# EAGLE design Charge_Li_ION (EAGLE 7.6.0)
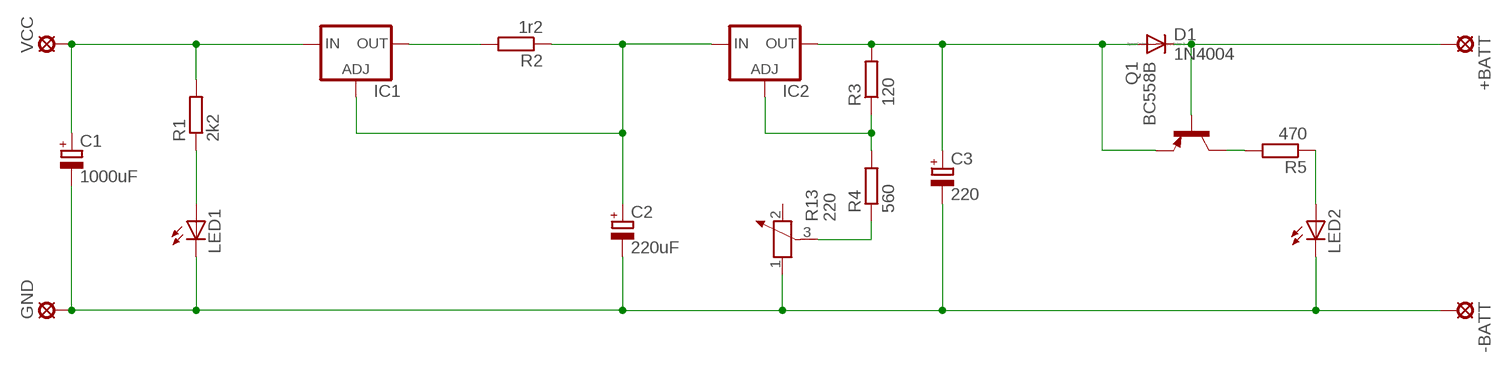
[diagram p0: schematic, sheet 1]

## Parts
+BATT  LSP13  [LSP13]
-BATT  LSP13  [LSP13]
C1  1000uF  CPOL-EUE3.5-8  [E3,5-8]
C2  220uF  CPOL-EUE3.5-8  [E3,5-8]
C3  220  CPOL-EUE3.5-8  [E3,5-8]
D1  1N4004  [DO41-10]
GND  LSP13  [LSP13]
IC1  LM317TS  [317TS]
IC2  LM317TS  [317TS]
LED1  LED5MM  [LED5MM]
LED2  LED5MM  [LED5MM]
Q1  BC558B  [TO92-EBC]
R1  2k2  R-EU_0207/7  [0207/7]
R2  1r2  R-EU_0207/7  [0207/7]
R3  120  R-EU_0207/7  [0207/7]
R4  560  R-EU_0207/7  [0207/7]
R5  470  R-EU_0207/7  [0207/7]
R13  220  POTENTIOMETER_PT-10  [PT-10]
VCC  LSP13  [LSP13]

## Nets
N$1: LED1.A R1.1
N$2: C1.+ IC1.3(IN) R1.2 VCC.MP
N$3: IC1.2(OUT) R2.2
N$5: -BATT.MP C1.- C2.- C3.- GND.MP LED1.K(C) LED2.K(C) R13.1
N$6: C2.+ IC1.1(ADJ) IC2.3(IN) R2.1
N$7: R4.1 R13.3
N$8: IC2.1(ADJ) R3.1 R4.2
N$9: C3.+ D1.A IC2.2(OUT) Q1.E R3.2
N$11: +BATT.MP D1.C Q1.B
N$13: Q1.C R5.2
N$14: LED2.A R5.1
Unconnected: R13.2

## Library data of the parts
+BATT -BATT GND VCC = solpad:LSP13: SOLDER PAD drill 1.3 mm, distributor Buerklin, 12H562
C1-C3 = rcl:CPOL-EU: POLARIZED CAPACITOR, European symbol
D1 = diode:1N4004: DIODE general purpose rectifier, 1 A
IC1 IC2 = v-reg:LM317TS: VOLTAGE REGULATOR
LED1 LED2 = led:LED: LED OSRAM: - CHIPLED LG R971, LG N971, LY N971, LG Q971, LY Q971, LO R971, LY R971 LH N974, LH R974 LS Q976, LO Q976, LY Q976 LO Q996 - Hyper CHIPLED LW Q18S LB Q993, LB Q99A, LB R99A - SideLED LS A670, LO A670, LY A670, LG A670, LP A670 LB A673, LV A673, LT A673, LW A673 LH A674 LY A675 LS A676, LA A676, LO A676, LY A676, LW A676 LS A679, LY A679, LG A679 - Hyper Micro SIDELED® LS Y876, LA Y876, LO Y876, LY Y876 LT Y87S - SmartLED LW L88C, LW L88S LB L89C, LB L89S, LG L890 LS L89K, LO L89K, LY L89K LS L896, LA L896, LO L896, LY L896 - TOPLED LS T670, LO T670, LY T670, LG T670, LP T670 LSG T670, LSP T670, LSY T670, LOP T670, LYG T670 LG T671, LOG T671, LSG T671 LB T673, LV T673, LT T673, LW T673 LH T674 LS T676, LA T676, LO T676, LY T676, LB T676, LH T676, LSB T676, LW T676 LB T67C, LV T67C, LT T67C, LS T67K, LO T67K, LY T67K, LW E67C LS E67B, LA E67B, LO E67B, LY E67B, LB E67C, LV E67C, LT E67C LW T67C LS T679, LY T679, LG T679 LS T770, LO T770, LY T770, LG T770, LP T770 LB T773, LV T773, LT T773, LW T773 LH T774 LS E675, LA E675, LY E675, LS T675 LS T776, LA T776, LO T776, LY T776, LB T776 LHGB T686 LT T68C, LB T68C - Hyper Mini TOPLED® LB M676 - Mini TOPLED Santana® LG M470 LS M47K, LO M47K, LY M47K Source: http://www.osram.convergy.de LUXEON: - LUMILED® LXK2-PW12-R00, LXK2-PW12-S00, LXK2-PW14-U00, LXK2-PW14-V00 LXK2-PM12-R00, LXK2-PM12-S00, LXK2-PM14-U00 LXK2-PE12-Q00, LXK2-PE12-R00, LXK2-PE12-S00, LXK2-PE14-T00, LXK2-PE14-U00 LXK2-PB12-K00, LXK2-PB12-L00, LXK2-PB12-M00, LXK2-PB14-N00, LXK2-PB14-P00, LXK2-PB14-Q00 LXK2-PR12-L00, LXK2-PR12-M00, LXK2-PR14-Q00, LXK2-PR14-R00 LXK2-PD12-Q00, LXK2-PD12-R00, LXK2-PD12-S00 LXK2-PH12-R00, LXK2-PH12-S00 LXK2-PL12-P00, LXK2-PL12-Q00, LXK2-PL12-R00 Source: www.luxeon.com KINGBRIGHT: KA-3528ASYC Source: www.kingbright.com
Q1 = transistor-pnp:BC558*: PNP Transistror
R1-R5 = rcl:R-EU_: RESISTOR, European symbol
R13 = rcl:POTENTIOMETER_: Potentiometer

## Board
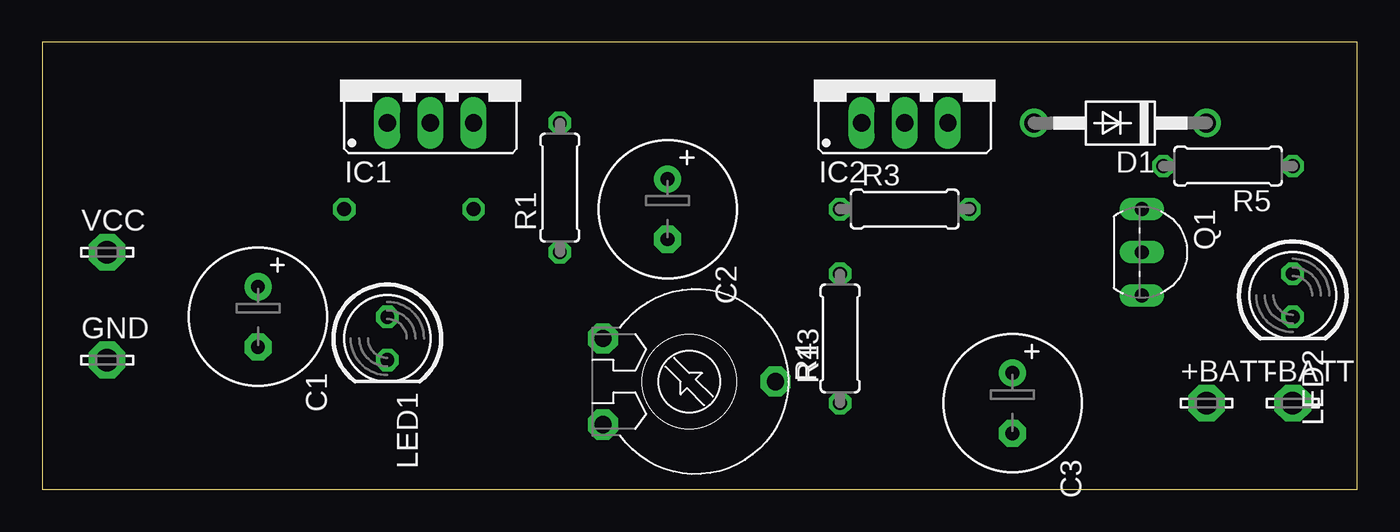
[diagram p1: board, top side]
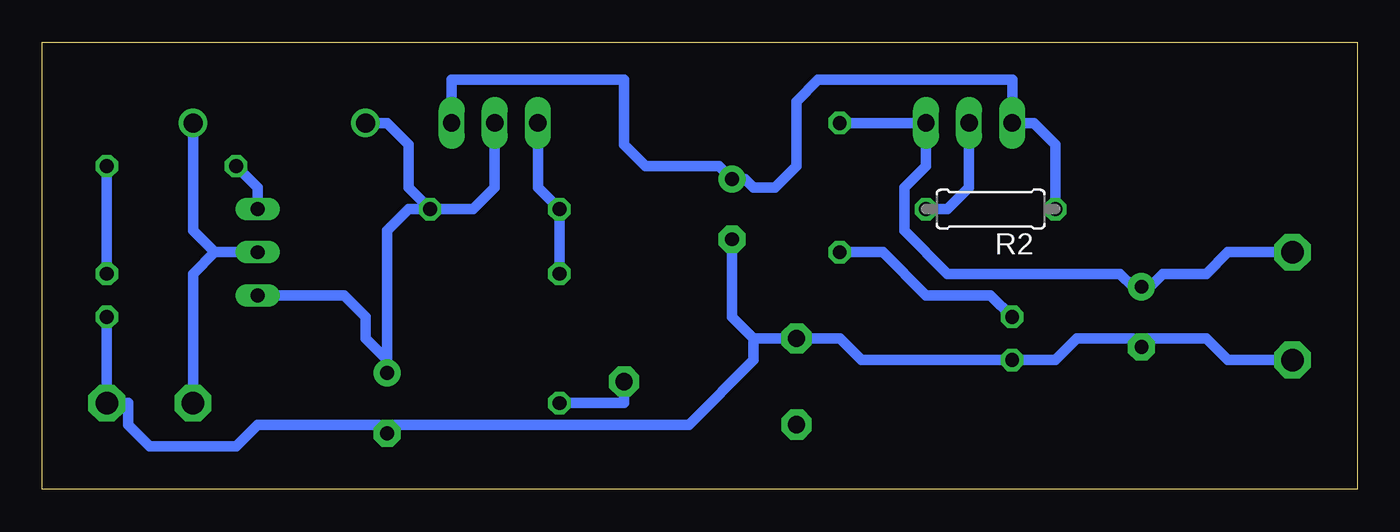
[diagram p2: board, bottom side, seen from below]

Size 77.45 x 26.34 mm. Coordinates in mm from the lower left corner, seen from the top.
Outline: 0,0 77.45,0 77.45,26.34 0,26.34 0,0
Copper layers (1*16): Top 0.035mm / dielectric 1.5mm / Bottom 0.035mm
Design rules "default": minimum track width 10mil, minimum drill 24mil, track to track 8mil, track to pad 8mil, pad to pad 8mil, via to via 8mil, smd to smd 8mil, copper to edge 40mil, drill to drill 8mil, minimum pad ring 10mil, minimum via ring 8mil, stop-mask expansion 4mil, vias tented up to drill 0mil, thermal gap 10mil

### Footprints (pad centres in the part's own frame; a part is rotated, then mirrored left to right if it is on the bottom)
LSP13 = drill 1.321 pad 2.159 octagon: MP 0,0
E3,5-8 = drill 0.813 pad 1.6: + -1.778,0 | drill 0.813 pad 1.6 octagon: - 1.778,0
DO41-10 = drill 1.118: A 5.08,0; C -5.08,0
317TS = drill 1.016 long: 1 -2.54,-2.54; 2 0,-2.54; 3 2.54,-2.54
LED5MM = drill 0.813 octagon: A -1.27,0; K 1.27,0
TO92-EBC = drill 0.813 long: B 0,-1.27; C -2.54,-1.27; E 2.54,-1.27
0207/7 = drill 0.813 octagon: 1 -3.81,0; 2 3.81,0
PT-10 = drill 1.016 pad 1.778 octagon: 1 -2.54,-5.08; 2 2.54,-5.08; 3 0,5.08

### Placement (x,y rotation side)
+BATT  68.58,5.08 0 top
-BATT  73.66,5.08 0 top
C1  12.7,10.16 270 top
C2  36.83,16.51 270 top
C3  57.15,5.08 270 top
D1  63.5,21.59 180 top
GND  3.81,7.62 0 top
IC1  22.86,24.13 0 top
IC2  50.8,24.13 0 top
LED1  20.32,8.89 270 top
LED2  73.66,11.43 270 top
Q1  66.04,13.97 270 top
R1  30.48,17.78 90 top
R2  21.59,16.51 180 bottom
R3  50.8,16.51 0 top
R4  46.99,8.89 90 top
R5  69.85,19.05 180 top
R13  38.1,6.35 270 top
VCC  3.81,13.97 0 top

### Tracks (layer width: path | path; a pad name or v marks a point on that pad's centre or on a via)
N$1
  Bottom 0.61: LED1.A 21.59,11.43 25.4,11.43 27.94,13.97 R1.1
N$2
  Bottom 0.61: R1.2 IC1.3 25.4,19.05 26.67,17.78 26.67,15.24 24.13,12.7 13.97,12.7 13.21,11.94 C1.+ 12.19,11.94 11.43,12.7 8.89,12.7 7.62,13.97 VCC.MP
N$3
  Bottom 0.61: R2.2 24.13,16.51 22.86,17.78 IC1.2
N$5
  Bottom 0.61: GND.MP 7.62,7.62 8.89,8.89 12.7,8.89 C1.- 13.21,8.89 16.51,8.89 17.78,7.62 LED1.K 29.21,7.62 30.48,8.89 R13.1 35.56,8.89 | C2.- 36.83,10.16 35.56,8.89 | 35.56,8.89 35.56,7.62 39.37,3.81 56.64,3.81 C3.- 57.66,3.81 64.77,3.81 66.04,2.54 71.12,2.54 72.39,3.81 72.39,5.08 -BATT.MP LED2.K
N$6
  Bottom 0.61: R2.1 17.78,20.32 19.05,21.59 IC1.1 20.32,24.13 31.75,24.13 33.02,22.86 33.02,19.05 34.29,17.78 35.56,17.78 36.07,18.29 C2.+ 37.59,19.05 41.91,19.05 43.18,20.32 43.18,24.13 53.34,24.13 IC2.3
N$7
  Bottom 0.61: R13.3 43.18,5.08 R4.1
N$8
  Bottom 0.61: R4.2 R3.1 48.26,17.78 IC2.1
N$9
  Bottom 0.61: IC2.2 50.8,17.78 52.07,16.51 R3.2 | D1.A 57.15,21.59 55.88,20.32 55.88,17.78 R3.2 | R3.2 55.88,16.51 57.15,15.24 57.15,7.62 | C3.+ 57.15,7.62 | 57.15,7.62 58.42,8.89 58.42,10.16 59.69,11.43 Q1.E
N$11
  Bottom 0.61: Q1.B 67.31,13.97 | 67.31,13.97 68.58,15.24 D1.C | +BATT.MP 68.58,12.7 67.31,13.97
N$13
  Bottom 0.61: Q1.C 64.77,17.78 R5.2
N$14
  Bottom 0.61: R5.1 LED2.A